# Altium schematic sheet 100068622_payload_detect.SchDoc
size 863 x 558 mm; SheetNumber: 4; SheetTotal: 6
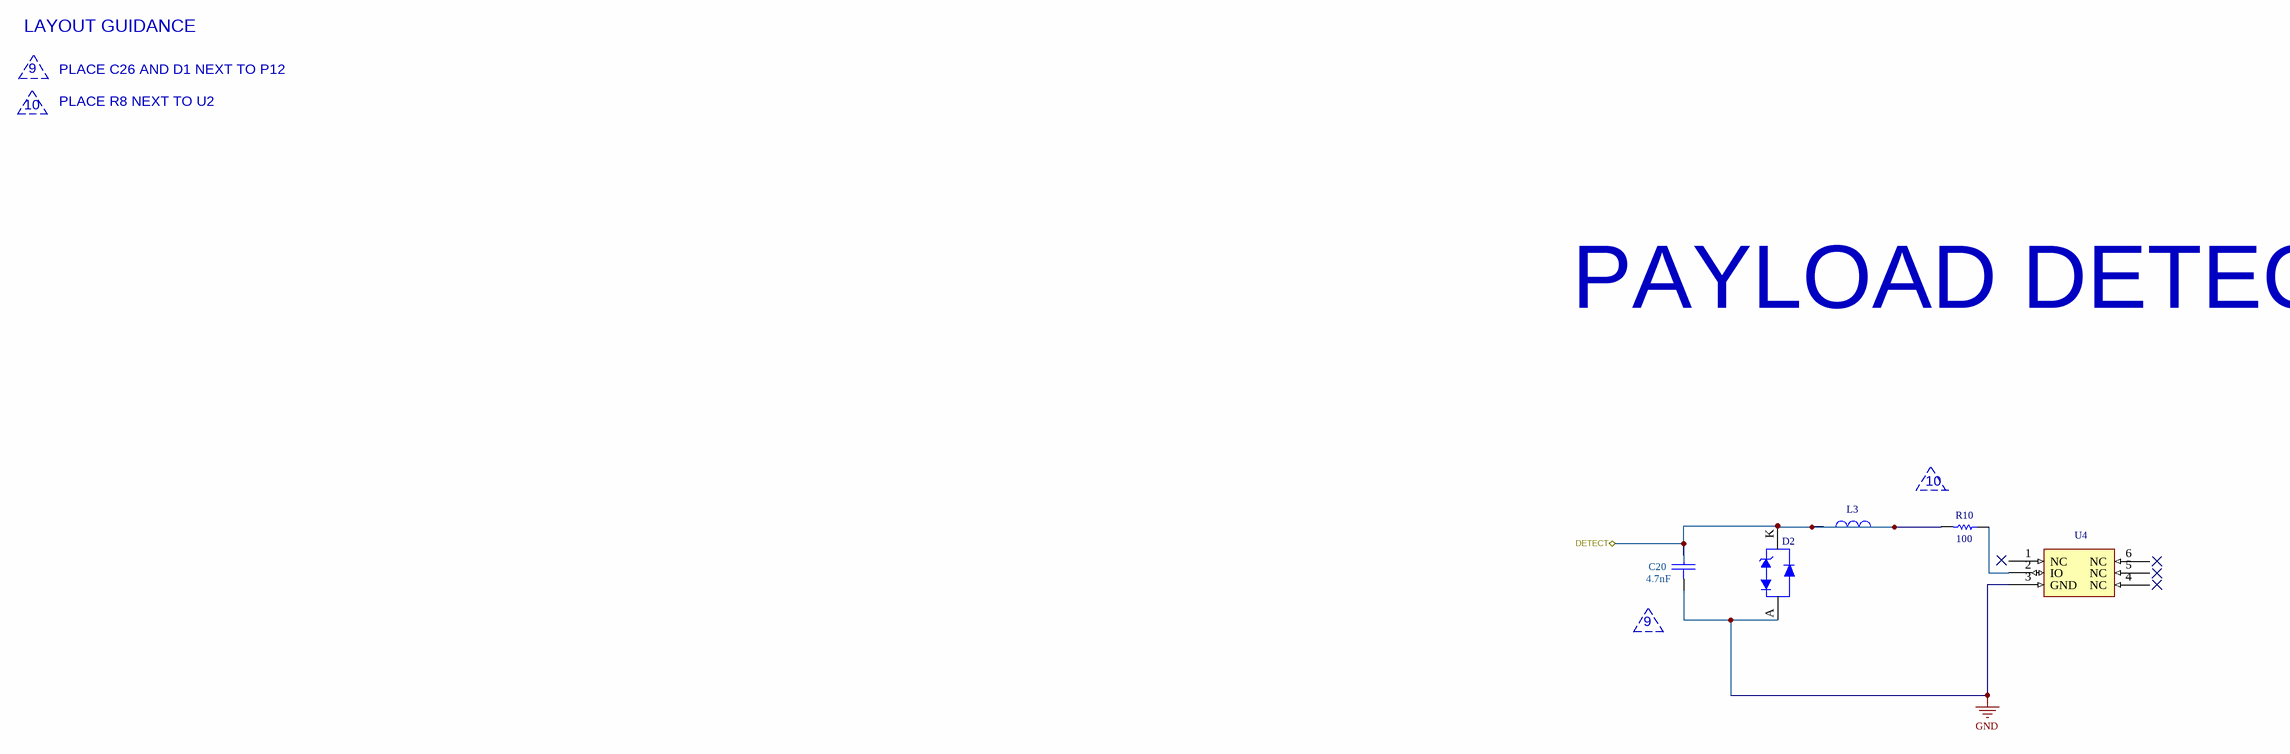
[diagram p0: 100068622_payload_detect.SchDoc]

## Parts
C20  value 4.7nF  [CAP-0402-A]  (hidden comment: CAP 0402 4700PF 50V 10% X7R)
D2  SMF3.3  [DI-SOD123F-A]  (value not drawn)
L3  MDF2016BSS270C  [IND-0806-A]  (value not drawn)
R10  value 100  [RES-0402-B]  (hidden comment: Res 0402 100 Ohm 0.1W 1% Thick Film)
U4  DS2431Q-TR  [IC-TDFN3X3-B]  (value not drawn)

## Ports
DETECT (bidir)

## Nets
GND: C20.1 D2.A U4.3(GND)
DETECT: C20.2 D2.K L3.1 L3.2 R10.1 ; port DETECT
NetR10_2: R10.2 U4.2(IO)

Not connected (* = marked no-connect by the designer): U4 1(NC) 4(NC) 5(NC) 6(NC)

## Notes on the sheet
- LAYOUT GUIDANCE
- 10
- 9
- PLACE R8 NEXT TO U2
- PLACE C26 AND D1 NEXT TO P12
- PAYLOAD DETECT
- DWG NO
- REVISIONS
- SH
- REVISION
- DESCRIPTION
- DATE(YEAR-MO-DA)
- APPROVED
- PART NO.
- DESIGN ACTIVITY
- US ARMY
  COMBAT CAPABILITIES DEVELOPMENT COMMAND ARMAMENTS CENTER
  PICATINNY ARSENAL, NEW JERSEY 07806-5000
- SIZE
- CAGE CODE
- DWG NO.
- D
- 19200
- SCALE
- NONE
- UNIT WT.
- ---
- SHEET

## Library data of the parts
C20 = CAP-00371-1: Leader Qty: 100; UOM: EA; Footprint: Capacitor_SMD:C_0402_1005Metric; Case/Package: 0402; Max Operating Temperature: 150°C; Min Operating Temperature: -55°C; Mounting Technology: Surface Mount; Tolerance: 10%
D2 = CMP-00658-1: ESD protection diodes / TVS diodes; LITTELFUSE; SMF3.3; 6.8 V; 30 A; 3.3 V; 3.4 V - 4.3 V; Breakdown Voltage: 3.85V; Clamping Voltage: 6.8V; Direction: Unidirectional; Forward Voltage: 16V; Max Breakdown Voltage: 4.3V; Max Junction Temperature (Tj): 150°C; Max Power Dissipation: 1.7W; Max Reverse Leakage Current: 500nA; Min Breakdown Voltage: 3.4V; Number of Channels: 1; Peak Pulse Current: 30A; Peak Pulse Power: 200W; Reverse Standoff Voltage: 3.3V; Test Current: 10mA; Footprint: 1a_Littelfuse:SOD-123FL; Country of Origin: Mainland China; Export Control Classification Number (ECCN) Code: EAR99; Harmonized Tariff Schedule (HTS) Code: 8541.10.00.50; Height: 1.08mm; Introduction Date: 2016-08-01; Lifecycle Status: Production; Max Operating Temperature: 150°C; Min Operating Temperature: -55°C; Number of Elements: 1; Number of Terminals: 2; Packaging: Cut Tape; Peak Reverse Current: 500nA; Polarity: Unidirectional; REACH SVHC: No; Reverse Voltage: 3.3V; RoHS: Compliant; Schedule B: 8541100080
L3 = CMP-00660-1: Ferrite Bead, Aec-Q200, 0806, 1A Rohs Compliant: Yes; Manufacturer Lifecycle Status: PRODUCTION; DC Resistance (DCR): 220mΩ; Impedance: 27Ω; Number of Circuits: 1; Footprint: 1a_Misc:0806 SMD; Current Rating: 1A; Export Control Classification Number (ECCN) Code: EAR99; Harmonized Tariff Schedule (HTS) Code: 8504.50.80.00; Height: 1mm; Introduction Date: 2021-03-10; Length: 2mm; Lifecycle Status: Production; Max Length: 2.2mm; Max Operating Temperature: 125°C; Max Width: 1.8mm; Min Length: 1.8mm; Min Operating Temperature: -40°C; Min Width: 1.4mm; Number of Terminals: 2; REACH SVHC: Yes; RoHS: Compliant; Width: 1.6mm
R10 = RES-00021-9: Power: 100mW; Voltage Rating: 100V; Footprint: Resistor_SMD:R_0402_1005Metric; Case/Package: 0402; Leader Qty: 100; Max Operating Temperature: 155°C; Min Operating Temperature: -55°C; Mounting Technology: SMD; Pins: 2; Tolerance: 1%
U4 = IC-00419-1: IC EEPROM 1KBIT 1-WIRE 6TDFN; Manufacturer Lifecycle Status: PRODUCTION; Density: 1kb; Interface: Serial; Max Supply Voltage: 5.25V; Memory Size: 128B; Min Supply Voltage: 2.8V; Footprint: Package_DFN_QFN:Maxim_TDFN-6-1EP_3x3mm_P0.95mm_EP1.5x2.3mm; Contact Plating: Tin; Lifecycle Status: Production; Max Operating Temperature: 85°C; Memory Format: EEPROM; Min Operating Temperature: -40°C; Pins: 6; Radiation Hardening: No; REACH SVHC: Unknown; RoHS: Compliant; Schedule B: 8542320050|8542320050|8542320050|8542320050|8542320050